# Altium schematic sheet RLD and screen.SchDoc
size A4
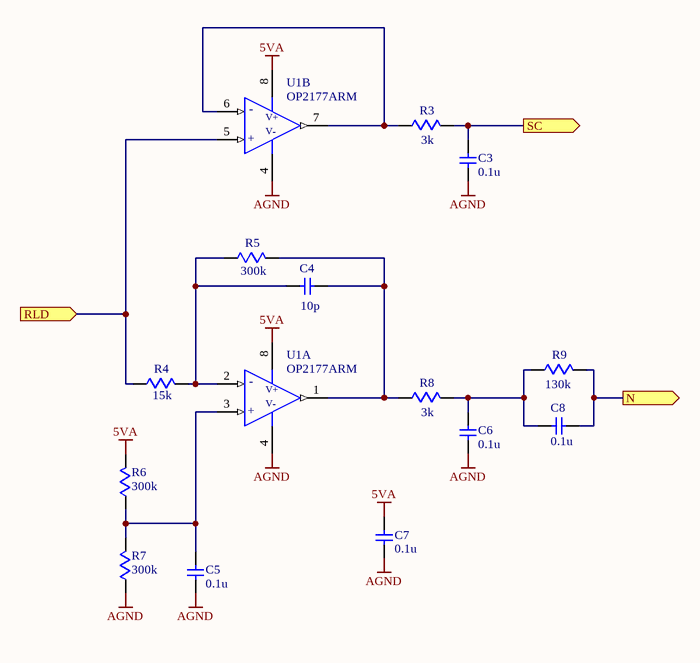
[diagram p0: RLD and screen.SchDoc]

## Parts
C3  0.1u  [SMD/C/0603]
C4  10p  [SMD/C/0603]
C5  0.1u  [SMD/C/0603]
C6  0.1u  [SMD/C/0603]
C7  0.1u  [SMD/C/0603]
C8  0.1u  [SMD/C/0603]
R3  3k  [SMD/R/0603]
R4  15k  [SMD/R/0603]
R5  300k  [SMD/R/0603]
R6  300k  [SMD/R/0603]
R7  300k  [SMD/R/0603]
R8  3k  [SMD/R/0603]
R9  130k  [SMD/R/0603]
U1  OP2177ARM  [SMD/SOP8/0.65MMP/3x3mm/4.9MMWP]  (parts A,B of 2)

## Ports
N (out), RLD (in), SC (out)

## Nets
5VA: C7.2 R6.2 U1.8(V+)
AGND: C3.1 C5.1 C6.1 C7.1 R7.1 U1.4(V-)
N: C8.1 R9.2 ; port N
RLD: R4.1 U1.5(+) ; port RLD
SC: C3.2 R3.2 ; port SC
NetC4_1: C4.1 R5.2 R8.1 U1.1(OUT)
NetC4_2: C4.2 R4.2 R5.1 U1.2(-)
NetC5_2: C5.2 R6.1 R7.2 U1.3(+)
NetC6_2: C6.2 C8.2 R8.2 R9.1
NetR3_1: R3.1 U1.6(-) U1.7(OUT)

## Library data of the parts
C3-C8 = Capacitor
  C3 C5-C8: Value: 0.1u
  C4: Value: 10p
R3-R9 = Resistor
  R3 R8: Value: 3k
  R4: Value: 15k
  R5-R7: Value: 300k
  R9: Value: 130k
U1 = OP2177ARM: Precision Low Noise, Low Input Bias Current Operational Amplifiers; Value: OP2177ARM